# Altium schematic sheet ADC.SchDoc
size A
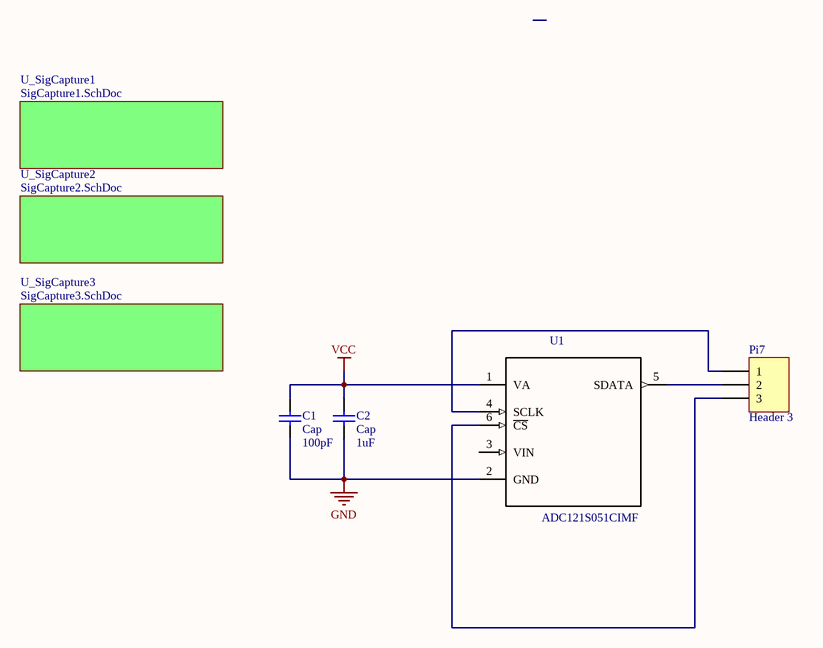
[diagram p0: ADC.SchDoc]

## Parts
C1  Cap  value 100pF  [RAD-0.3]
C2  Cap  value 1uF  [RAD-0.3]
Pi7  Header 3  [HDR1X3]
U1  ADC121S051CIMF  [SOT95P284X122-6N]

## Sub-sheets
U_SigCapture1 = SigCapture1.SchDoc: no entries
U_SigCapture2 = SigCapture2.SchDoc: no entries
U_SigCapture3 = SigCapture3.SchDoc: no entries

## Nets
GND: C1.2 C2.1 U1.2(GND)
VCC: C1.1 C2.2 U1.1(VA)
NetPi7_1: Pi7.1 U1.4(SCLK)
NetPi7_2: Pi7.2 U1.5(SDATA)
NetPi7_3: Pi7.3 U1.6(~{CS})

Not connected (* = marked no-connect by the designer): U1 3(VIN)

## Library data of the parts
C1 C2 = Cap: Capacitor; Published: 8-Jun-2000; LatestRevisionDate: 17-Jul-2002; LatestRevisionNote: Re-released for DXP Platform.; PackageReference: RAD-0.3; Publisher: Altium Limited; PackageDescription: Radial Cap, Thru-Hole; 2 Leads; 0.3 in Pin Spacing
Pi7 = Header 3: Header, 3-Pin; LatestRevisionDate: 17-Jul-2002; LatestRevisionNote: Re-released for DXP Platform.; Publisher: Altium Limited
U1 = ADC121S051CIMF: Single Channel, 200 to 500 ksps, 12-Bit A/D Converter 6-SOT-23 -40 to 85; MP: ADC121S051CIMF/NOPB; MF: Texas Instruments; Price: None; Availability: Unavailable; Package: SOT-23 Texas Instruments; SnapEDA_Link: https://www.snapeda.com/parts/ADC121S051CIMF/NOPB/Texas%20Instruments/view-part/?ref=snap; Value: *